# Altium schematic sheet 14 LCD Power Supply.SchDoc
size C; DocumentNumber: 14; SheetNumber: 14; SheetTotal: 17
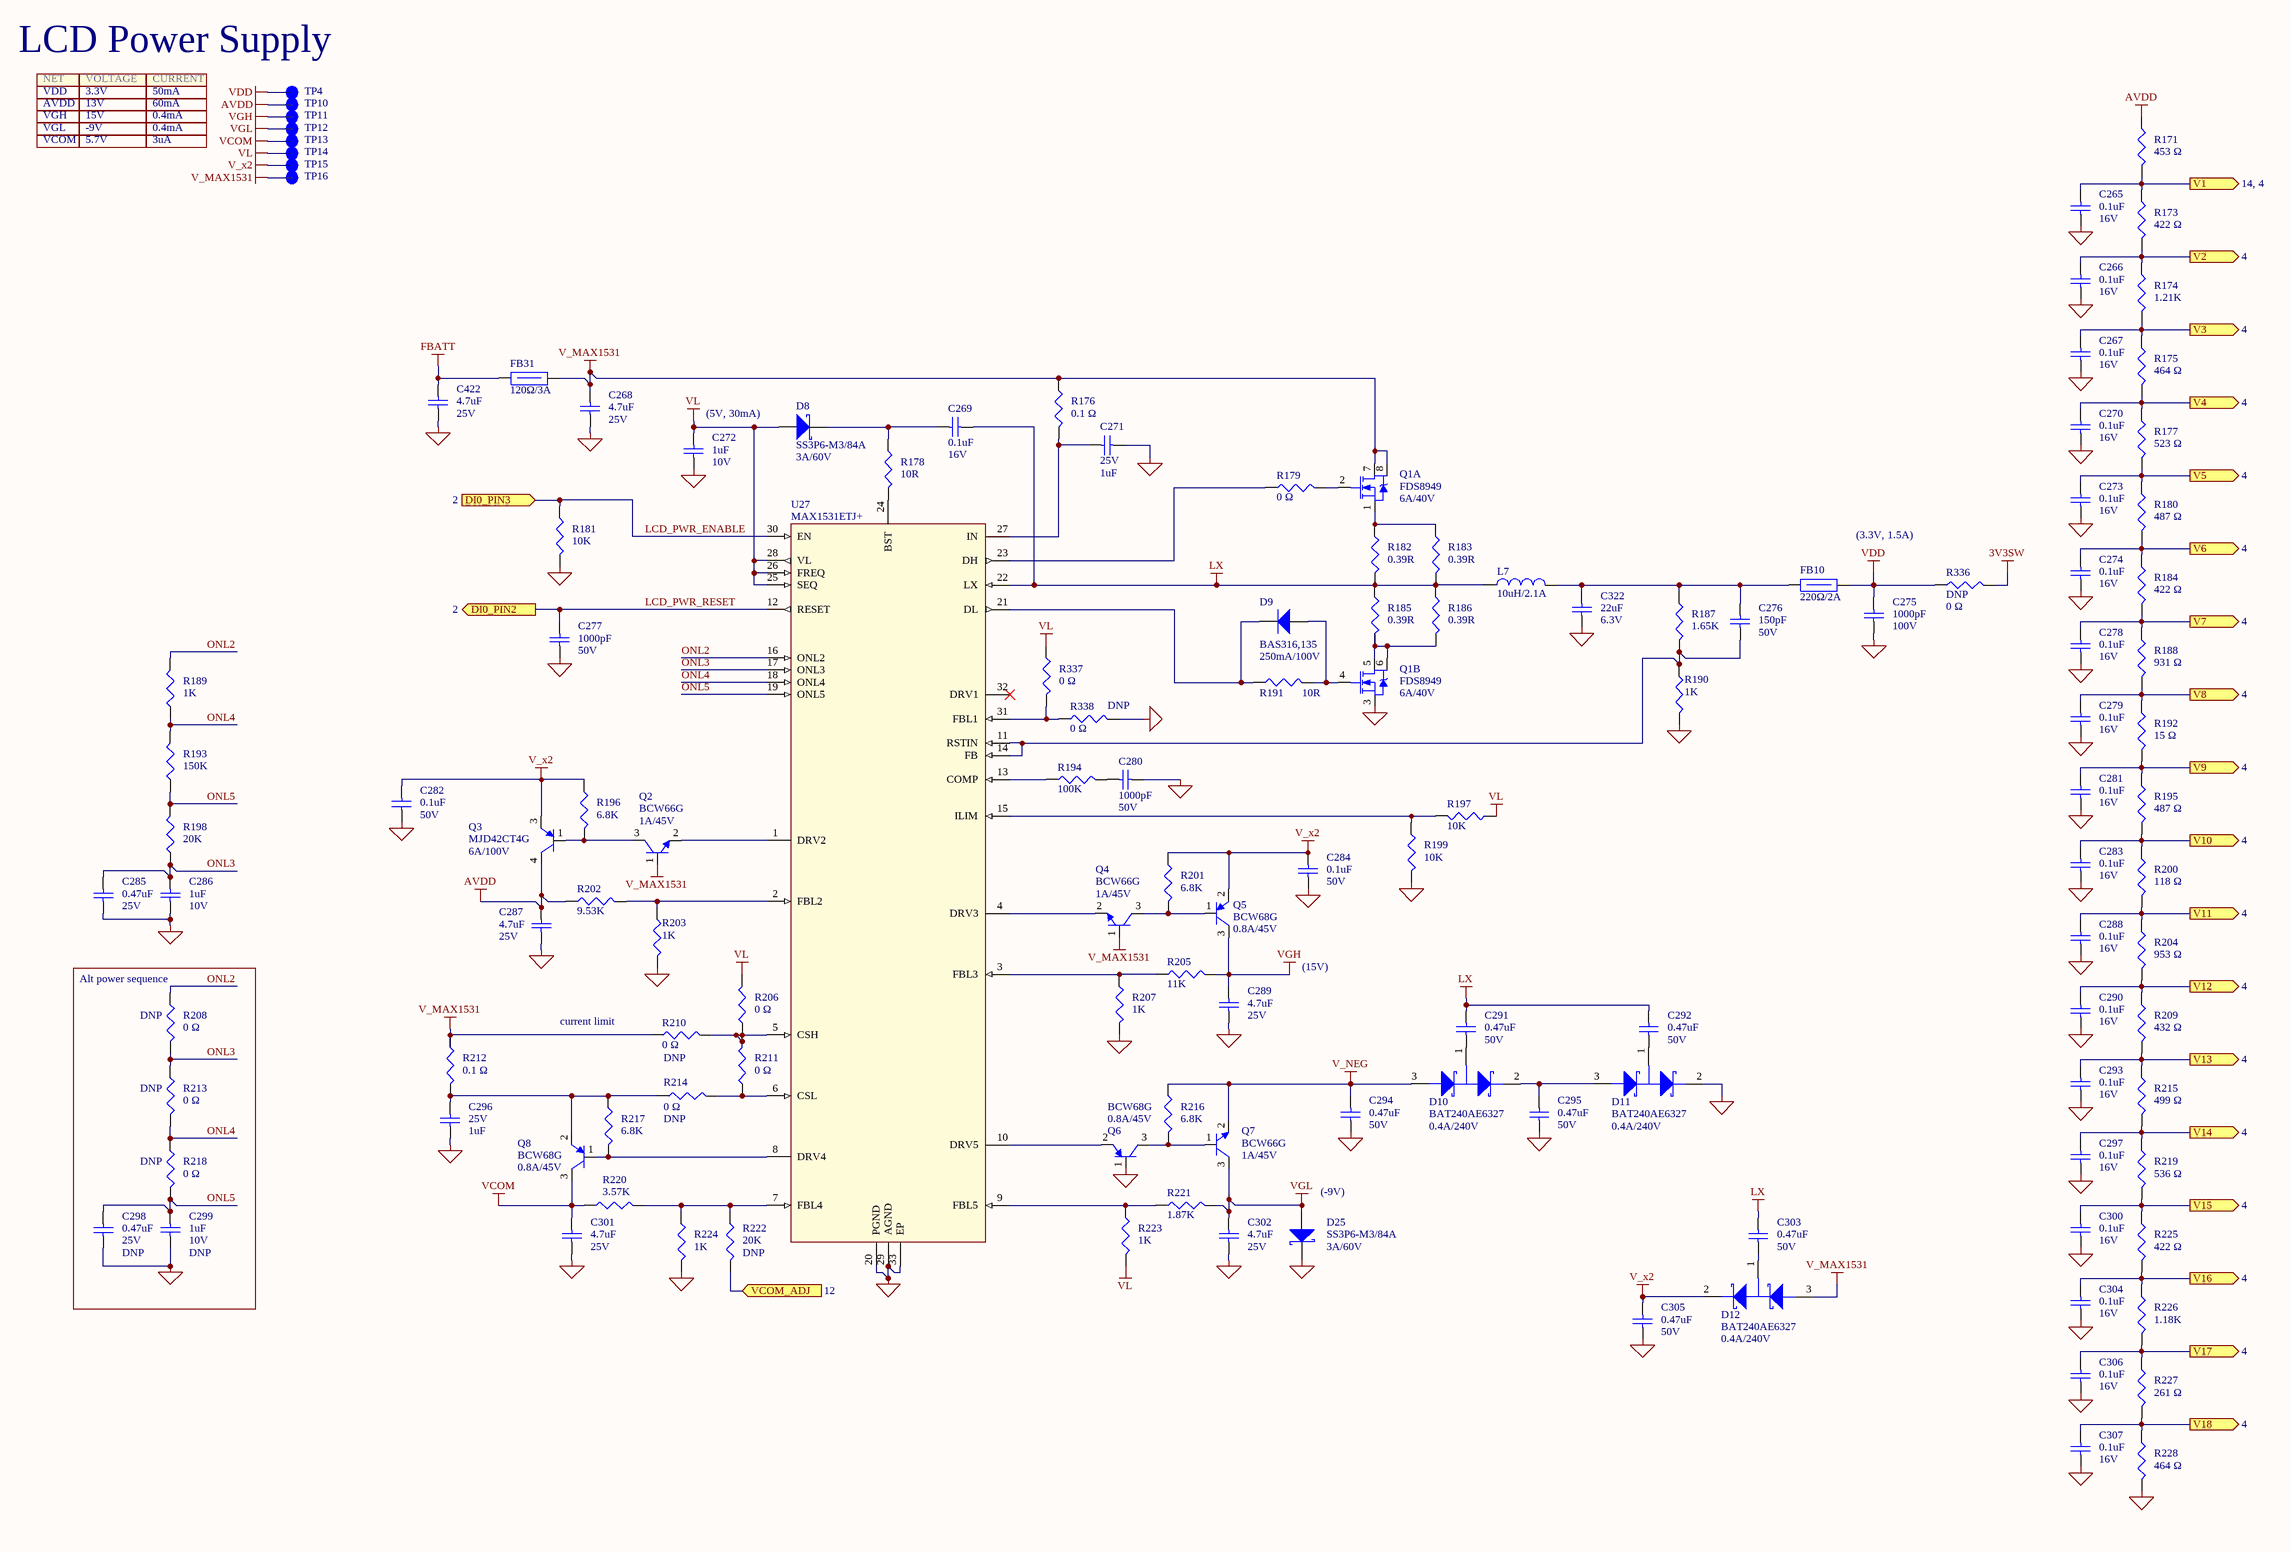
[diagram p0: 14 LCD Power Supply.SchDoc]

## Parts
C265  value 0.1uF  Voltage: 16V  [CAP_0402]  (hidden comment: Cap 0.1uF 16V 0402)
C266  value 0.1uF  Voltage: 16V  [CAP_0402]  (hidden comment: Cap 0.1uF 16V 0402)
C267  value 0.1uF  Voltage: 16V  [CAP_0402]  (hidden comment: Cap 0.1uF 16V 0402)
C268  value 4.7uF  Voltage: 25V  [CAP_0805]  (hidden comment: Cap 4.7uF 25V 0805)
C269  value 0.1uF  Voltage: 16V  [CAP_0402]  (hidden comment: Cap 0.1uF 16V 0402)
C270  value 0.1uF  Voltage: 16V  [CAP_0402]  (hidden comment: Cap 0.1uF 16V 0402)
C271  value 1uF  Voltage: 25V  [CAP_0402]  (hidden comment: Cap 1uF 25V 0402)
C272  value 1uF  Voltage: 10V  [CAP_0402]  (hidden comment: Cap 1uF 10V 0402)
C273  value 0.1uF  Voltage: 16V  [CAP_0402]  (hidden comment: Cap 0.1uF 16V 0402)
C274  value 0.1uF  Voltage: 16V  [CAP_0402]  (hidden comment: Cap 0.1uF 16V 0402)
C275  value 1000pF  Voltage: 100V  [CAP_0402]  (hidden comment: Cap 1000pF 100V 0402)
C276  value 150pF  Voltage: 50V  [CAP_0402]  (hidden comment: Cap 150pF 50V 0603)
C277  value 1000pF  Voltage: 50V  [CAP_0603]  (hidden comment: Cap 1000pF 50V 0603)
C278  value 0.1uF  Voltage: 16V  [CAP_0402]  (hidden comment: Cap 0.1uF 16V 0402)
C279  value 0.1uF  Voltage: 16V  [CAP_0402]  (hidden comment: Cap 0.1uF 16V 0402)
C280  value 1000pF  Voltage: 50V  [CAP_0603]  (hidden comment: Cap 1000pF 50V 0603)
C281  value 0.1uF  Voltage: 16V  [CAP_0402]  (hidden comment: Cap 0.1uF 16V 0402)
C282  value 0.1uF  Voltage: 50V  [CAP_0402]  (hidden comment: Cap 0.1uF 50V 0402)
C283  value 0.1uF  Voltage: 16V  [CAP_0402]  (hidden comment: Cap 0.1uF 16V 0402)
C284  value 0.1uF  Voltage: 50V  [CAP_0402]  (hidden comment: Cap 0.1uF 50V 0402)
C285  value 0.47uF  Voltage: 25V  [CAP_0603]  (hidden comment: Cap 0.47uF 25V 0603)
C286  value 1uF  Voltage: 10V  [CAP_0402]  (hidden comment: Cap 1uF 10V 0402)
C287  value 4.7uF  Voltage: 25V  [CAP_0805]  (hidden comment: Cap 4.7uF 25V 0805)
C288  value 0.1uF  Voltage: 16V  [CAP_0402]  (hidden comment: Cap 0.1uF 16V 0402)
C289  value 4.7uF  Voltage: 25V  [CAP_0805]  (hidden comment: Cap 4.7uF 25V 0805)
C290  value 0.1uF  Voltage: 16V  [CAP_0402]  (hidden comment: Cap 0.1uF 16V 0402)
C291  value 0.47uF  Voltage: 50V  [CAP_1206]  (hidden comment: Cap 0.47uF 50V 1206)
C292  value 0.47uF  Voltage: 50V  [CAP_1206]  (hidden comment: Cap 0.47uF 50V 1206)
C293  value 0.1uF  Voltage: 16V  [CAP_0402]  (hidden comment: Cap 0.1uF 16V 0402)
C294  value 0.47uF  Voltage: 50V  [CAP_1206]  (hidden comment: Cap 0.47uF 50V 1206)
C295  value 0.47uF  Voltage: 50V  [CAP_1206]  (hidden comment: Cap 0.47uF 50V 1206)
C296  value 1uF  Voltage: 25V  [CAP_0402]  (hidden comment: Cap 1uF 25V 0402)
C297  value 0.1uF  Voltage: 16V  [CAP_0402]  (hidden comment: Cap 0.1uF 16V 0402)
C298  value 0.47uF  Voltage: 25V  [CAP_0603]  (hidden comment: Cap 0.47uF 25V 0603)
C299  value 1uF  Voltage: 10V  [CAP_0402]  (hidden comment: Cap 1uF 10V 0402)
C300  value 0.1uF  Voltage: 16V  [CAP_0402]  (hidden comment: Cap 0.1uF 16V 0402)
C301  value 4.7uF  Voltage: 25V  [CAP_0805]  (hidden comment: Cap 4.7uF 25V 0805)
C302  value 4.7uF  Voltage: 25V  [CAP_0805]  (hidden comment: Cap 4.7uF 25V 0805)
C303  value 0.47uF  Voltage: 50V  [CAP_1206]  (hidden comment: Cap 0.47uF 50V 1206)
C304  value 0.1uF  Voltage: 16V  [CAP_0402]  (hidden comment: Cap 0.1uF 16V 0402)
C305  value 0.47uF  Voltage: 50V  [CAP_1206]  (hidden comment: Cap 0.47uF 50V 1206)
C306  value 0.1uF  Voltage: 16V  [CAP_0402]  (hidden comment: Cap 0.1uF 16V 0402)
C307  value 0.1uF  Voltage: 16V  [CAP_0402]  (hidden comment: Cap 0.1uF 16V 0402)
C322  value 22uF  Voltage: 6.3V  [CAP_0805]  (hidden comment: Cap 22uF 6.3V 0805)
C422  value 4.7uF  Voltage: 25V  [CAP_0805]  (hidden comment: Cap 4.7uF 25V 0805)
D8  SS3P6-M3/84A  value 3A/60V  [DO-220AA_SS3P6-M3/84A]
D9  BAS316,135  value 250mA/100V  [SOD-323-BAS316,135]
D10  BAT240AE6327  value 0.4A/240V  [SOT-23-3_BAT240AE6327]
D11  BAT240AE6327  value 0.4A/240V  [SOT-23-3_BAT240AE6327]
D12  BAT240AE6327  value 0.4A/240V  [SOT-23-3_BAT240AE6327]
D25  SS3P6-M3/84A  value 3A/60V  [DO-220AA_SS3P6-M3/84A]
FB10  value 220Ω/2A  [IND_0805]  (hidden comment: BKP2125HS221-T)
FB31  value 120Ω/3A  [IND_0603]  (hidden comment: BLM18KG121TN1D)
L7  value 10uH/2.1A  [IND_2020]  (hidden comment: TYS5040100M-10)
Q1  FDS8949  value 6A/40V  [SOIC-8_FDS8949]  (parts A,B of 2)
Q2  BCW66G  value 1A/45V  [SOT-23-3_BCW66G]
Q3  MJD42CT4G  value 6A/100V  [TO-252-3_MJD42CT4G]
Q4  BCW66G  value 1A/45V  [SOT-23-3_BCW66G]
Q5  BCW68G  value 0.8A/45V  [SOT-23-3_BCW68G]
Q6  BCW68G  value 0.8A/45V  [SOT-23-3_BCW68G]
Q7  BCW66G  value 1A/45V  [SOT-23-3_BCW66G]
Q8  BCW68G  value 0.8A/45V  [SOT-23-3_BCW68G]
R171  value 453 Ω  [RES_0402]  (hidden comment: Res 453R 0.063W)
R173  value 422 Ω  [RES_0402]  (hidden comment: Res 442R 0.063W)
R174  value 1.21K  [RES_0402]  (hidden comment: Res 1.21K 0.063W)
R175  value 464 Ω  [RES_0402]  (hidden comment: Res 464R 0.063W)
R176  value 0.1 Ω  [RES_1206]  (hidden comment: Res 0.1 ohm 1W)
R177  value 523 Ω  [RES_0402]  (hidden comment: Res 523R 0.063W)
R178  value 10R  [RES_0402]  (hidden comment: Res 10R 0.1W)
R179  value 0 Ω  [RES_0402]  (hidden comment: Res 0 ohm 0.1W)
R180  value 487 Ω  [RES_0402]  (hidden comment: Res 487R 0.063W)
R181  value 10K  [RES_0402]  (hidden comment: Res 10K 0.063W)
R182  value 0.39R  [RES_0805]  (hidden comment: Res 0.39R 0.25W)
R183  value 0.39R  [RES_0805]  (hidden comment: Res 0.39R 0.25W)
R184  value 422 Ω  [RES_0402]  (hidden comment: Res 442R 0.063W)
R185  value 0.39R  [RES_0805]  (hidden comment: Res 0.39R 0.25W)
R186  value 0.39R  [RES_0805]  (hidden comment: Res 0.39R 0.25W)
R187  value 1.65K  [RES_0402]  (hidden comment: Res 1.65K 0.1W)
R188  value 931 Ω  [RES_0402]  (hidden comment: Res 931R 0.063W)
R189  value 1K  [RES_0402]  (hidden comment: Res 1K 0.063W)
R190  value 1K  [RES_0402]  (hidden comment: Res 1K 0.063W)
R191  value 10R  [RES_0402]  (hidden comment: Res 10R 0.1W)
R192  value 15 Ω  [RES_0402]  (hidden comment: Res 15R 0.063W)
R193  value 150K  [RES_0402]  (hidden comment: Res 150K 0.063W)
R194  value 100K  [RES_0402]  (hidden comment: Res 100K 0.1W)
R195  value 487 Ω  [RES_0402]  (hidden comment: Res 487R 0.063W)
R196  value 6.8K  [RES_0402]  (hidden comment: Res 6.8K 0.1W)
R197  value 10K  [RES_0402]  (hidden comment: Res 10K 0.063W)
R198  value 20K  [RES_0402]  (hidden comment: Res 20K 0.1W)
R199  value 10K  [RES_0402]  (hidden comment: Res 10K 0.063W)
R200  value 118 Ω  [RES_0402]  (hidden comment: Res 118R 0.063W)
R201  value 6.8K  [RES_0402]  (hidden comment: Res 6.8K 0.1W)
R202  value 9.53K  [RES_0402]  (hidden comment: Res 9.53K 0.063W)
R203  value 1K  [RES_0402]  (hidden comment: Res 1K 0.063W)
R204  value 953 Ω  [RES_0402]  (hidden comment: Res 953R 0.063W)
R205  value 11K  [RES_0402]  (hidden comment: Res 11K 0.1W)
R206  value 0 Ω  [RES_0402]  (hidden comment: Res 0 ohm 0.1W)
R207  value 1K  [RES_0402]  (hidden comment: Res 1K 0.063W)
R208  value 0 Ω  [RES_0402]  (hidden comment: Res 0 ohm 0.1W)
R209  value 432 Ω  [RES_0402]  (hidden comment: Res 432R 0.063W)
R210  value 0 Ω  [RES_0402]  (hidden comment: Res 0 ohm 0.1W)
R211  value 0 Ω  [RES_0402]  (hidden comment: Res 0 ohm 0.1W)
R212  value 0.1 Ω  [RES_1206]  (hidden comment: Res 0.1 ohm 1W)
R213  value 0 Ω  [RES_0402]  (hidden comment: Res 0 ohm 0.1W)
R214  value 0 Ω  [RES_0402]  (hidden comment: Res 0 ohm 0.1W)
R215  value 499 Ω  [RES_0402]  (hidden comment: Res 499R 0.063W)
R216  value 6.8K  [RES_0402]  (hidden comment: Res 6.8K 0.1W)
R217  value 6.8K  [RES_0402]  (hidden comment: Res 6.8K 0.1W)
R218  value 0 Ω  [RES_0402]  (hidden comment: Res 0 ohm 0.1W)
R219  value 536 Ω  [RES_0402]  (hidden comment: Res 536R 0.063W)
R220  value 3.57K  [RES_0402]  (hidden comment: Res 3.57K 0.1W)
R221  value 1.87K  [RES_0402]  (hidden comment: Res 1.87K 0.063W)
R222  value 20K  [RES_0402]  (hidden comment: Res 20K 0.1W)
R223  value 1K  [RES_0402]  (hidden comment: Res 1K 0.063W)
R224  value 1K  [RES_0402]  (hidden comment: Res 1K 0.063W)
R225  value 422 Ω  [RES_0402]  (hidden comment: Res 442R 0.063W)
R226  value 1.18K  [RES_0402]  (hidden comment: Res 1.18K 0.063W)
R227  value 261 Ω  [RES_0402]  (hidden comment: Res 261R 0.063W)
R228  value 464 Ω  [RES_0402]  (hidden comment: Res 464R 0.063W)
R336  value 0 Ω  [RES_0402]  (hidden comment: Res 0 ohm 0.1W DNP)
R337  value 0 Ω  [RES_0402]  (hidden comment: Res 0 ohm 0.1W)
R338  value 0 Ω  [RES_0402]  (hidden comment: Res 0 ohm 0.1W)
TP4  TP  [TP_TH_12_20]  (value not drawn)  (no BOM)
TP10  TP  [TP_TH_12_20]  (value not drawn)  (no BOM)
TP11  TP  [TP_TH_12_20]  (value not drawn)  (no BOM)
TP12  TP  [TP_TH_12_20]  (value not drawn)  (no BOM)
TP13  TP  [TP_TH_12_20]  (value not drawn)  (no BOM)
TP14  TP  [TP_TH_12_20]  (value not drawn)  (no BOM)
TP15  TP  [TP_TH_12_20]  (value not drawn)  (no BOM)
TP16  TP  [TP_TH_12_20]  (value not drawn)  (no BOM)
U27  MAX1531ETJ+  [TQFN-32_MAX1531ETJ+]

## Blocks framed on the sheet
Alt power sequence: C298 C299 R208 R213 R218

## Ports
DI0_PIN2 (out, see 2), DI0_PIN3 (in, see 2), V1 (out, see 14, 4), V2 (out, see 4), V3 (out, see 4), V4 (out, see 4), V5 (out, see 4), V6 (out, see 4), V7 (out, see 4), V8 (out, see 4), V9 (out, see 4), V10 (out, see 4), V11 (out, see 4), V12 (out, see 4), V13 (out, see 4), V14 (out, see 4), V15 (out, see 4), V16 (out, see 4), V17 (out, see 4), V18 (out, see 4), VCOM_ADJ (in, see 12)

## Nets
3V3SW: R336.2
AVDD: C287.1 Q3.4(C) R171.1 R202.1 TP10.1
FBATT: C422.1 FB31.1
GND: C265.2 C266.2 C267.2 C268.2 C270.2 C271.2 C272.2 C273.2 C274.2 C275.2 C277.2 C278.2 C279.2 C280.2 C281.2 C282.2 C283.2 C284.2 C285.2 C286.2 C287.2 C288.2 C289.2 C290.2 C293.2 C294.2 C295.2 C296.2 C297.2 C298.2 C299.2 C300.2 C301.2 C302.2 C304.2 C305.2 C306.2 C307.2 C322.2 C422.2 D11.2(K2) D25.K Q1.3(S2) Q6.1(B) R181.2 R190.2 R199.2 R203.2 R207.2 R224.2 R228.2 R338.2 U27.20(PGND) U27.29(AGND) U27.33(EP)
LX: C269.2 C291.2 C292.2 C303.1 L7.1 R182.2 R183.2 R185.1 R186.1 U27.22(LX)
V_MAX1531: C268.1 D12.3(A1) FB31.2 Q1.7(D1) Q1.8(D1) Q2.1(B) Q4.1(B) R176.1 R210.1 R212.1 TP16.1
V_NEG: C294.1 D10.3(A1) Q7.2(E) R216.1
V_x2: C282.1 C284.1 C305.1 D12.2(K2) Q3.3(E) Q5.2(E) R196.1 R201.1 TP15.1
VCOM: C301.1 Q8.3(C) R220.1 TP13.1
VDD: C275.1 FB10.2 R336.1 TP4.1
VGH: C289.1 Q5.3(C) R205.2 TP11.1
VGL: C302.1 D25.A Q7.3(C) R221.2 TP12.1
VL: C272.1 D8.A R197.1 R206.2 R223.2 R337.1 TP14.1 U27.25(SEQ) U27.26(FREQ) U27.28(VL)
LCD_PWR_ENABLE: R181.1 U27.30(EN) ; port DI0_PIN3
LCD_PWR_RESET: C277.1 U27.12(RESET) ; port DI0_PIN2
ONL2: R189.2 R208.1 U27.16(ONL2)
ONL3: C285.1 C286.1 R198.1 R208.2 R213.1 U27.17(ONL3)
ONL4: R189.1 R193.2 R213.2 R218.1 U27.18(ONL4)
ONL5: C298.1 C299.1 R193.1 R198.2 R218.2 U27.19(ONL5)
V1: C265.1 R171.2 R173.1 ; port V1
V2: C266.1 R173.2 R174.1 ; port V2
V3: C267.1 R174.2 R175.1 ; port V3
V4: C270.1 R175.2 R177.1 ; port V4
V5: C273.1 R177.2 R180.1 ; port V5
V6: C274.1 R180.2 R184.1 ; port V6
V7: C278.1 R184.2 R188.1 ; port V7
V8: C279.1 R188.2 R192.1 ; port V8
V9: C281.1 R192.2 R195.1 ; port V9
V10: C283.1 R195.2 R200.1 ; port V10
V11: C288.1 R200.2 R204.1 ; port V11
V12: C290.1 R204.2 R209.1 ; port V12
V13: C293.1 R209.2 R215.1 ; port V13
V14: C297.1 R215.2 R219.1 ; port V14
V15: C300.1 R219.2 R225.1 ; port V15
V16: C304.1 R225.2 R226.1 ; port V16
V17: C306.1 R226.2 R227.1 ; port V17
V18: C307.1 R227.2 R228.1 ; port V18
VCOM_ADJ: R222.2 ; port VCOM_ADJ
NetC269_1: C269.1 D8.K R178.1
NetC271_1: C271.1 R176.2 U27.27(IN)
NetC276_1: C276.1 C322.1 FB10.1 L7.2 R187.1
NetC276_2: C276.2 R187.2 R190.1 U27.11(RSTIN) U27.14(FB)
NetC280_1: C280.1 R194.2
NetC291_1: C291.1 D10.1
NetC292_1: C292.1 D11.1
NetC295_1: C295.1 D10.2(K2) D11.3(A1)
NetC296_1: C296.1 Q8.2(E) R212.2 R214.1 R217.1
NetC303_2: C303.2 D12.1
NetD9_A: D9.A Q1.4(G2) R191.2
NetD9_K: D9.K R191.1 U27.21(DL)
NetQ1_1: Q1.1(S1) R182.1 R183.1
NetQ1_2: Q1.2(G1) R179.2
NetQ1_5: Q1.5(D2) Q1.6(D2) R185.2 R186.2
NetQ2_2: Q2.2(E) U27.1(DRV2)
NetQ2_3: Q2.3(C) Q3.1(B) R196.2
NetQ4_2: Q4.2(E) U27.4(DRV3)
NetQ4_3: Q4.3(C) Q5.1(B) R201.2
NetQ6_2: Q6.2(E) U27.10(DRV5)
NetQ6_3: Q6.3(C) Q7.1(B) R216.2
NetQ8_1: Q8.1(B) R217.2 U27.8(DRV4)
NetR178_2: R178.2 U27.24(BST)
NetR179_1: R179.1 U27.23(DH)
NetR194_1: R194.1 U27.13(COMP)
NetR197_2: R197.2 R199.1 U27.15(ILIM)
NetR202_2: R202.2 R203.1 U27.2(FBL2)
NetR205_1: R205.1 R207.1 U27.3(FBL3)
NetR206_1: R206.1 R210.2 R211.2 U27.5(CSH)
NetR211_1: R211.1 R214.2 U27.6(CSL)
NetR220_2: R220.2 R222.1 R224.1 U27.7(FBL4)
NetR221_1: R221.1 R223.1 U27.9(FBL5)
NetR337_2: R337.2 R338.1 U27.31(FBL1)

Not connected (* = marked no-connect by the designer): U27 32(DRV1)*

## Notes on the sheet
- LCD Power Supply
- VDD
- NET
- AVDD
- VGH
- 3.3V
- VOLTAGE
- 13V
- 15V
- CURRENT
- 50mA
- 60mA
- 0.4mA
- VGL
- VCOM
- -9V
- 5.7V
- 3uA
- (5V, 30mA)
- (3.3V, 1.5A)
- (15V)
- (near R210) current limit
- (near D25) (-9V)
- First View Consultants
- Austin, Tx
- 512.582.9102
- Drawn:
- Title:
- Sheet
- of
- firstviewconsultants.com
- FVC #:
- Checked:
- Approved:
- Date:
- File:
- Rev.
- Time:

## Library data of the parts
C265-C267 C269 C270 C273 C274 C278 C279 C281 C283 C288 C290 C293 C297 C300 C304 C306 C307 = Cap 0.1uF 16V 0402: Cap, Cer, 0.1uF, 16V, 10%, X7R, 0402; Manufacturer #: GRM155R71C104KA88D; Manufacturer: Murata Electronics North America; Have Footprint: yes; Package: 0402; Tolerance: ±10%
C268 C287 C289 C301 C302 C422 = Cap 4.7uF 25V 0805: Cap, Cer, 4.7uF, 25V, 10%, X5R, 0805; Manufacturer: Murata Electronics North America; Manufacturer #: GRM21BR61E475KA12K; Have Footprint: yes; Tolerance: 10%; PACKAGE: 0805
C271 C296 = Cap 1uF 25V 0402: Cap, Cer, 1uF, 25V, 10%, X5R, 0402; Manufacturer #: TMK105BJ105MV-F; Manufacturer: Taiyo Yuden; Have Footprint: yes; Package: 0402
C272 C286 C299 = Cap 1uF 10V 0402: Cap, Cer, 1uF, 10V, ±10%, X5R, 0402; Manufacturer #: CC0402KRX5R6BB105; Manufacturer: Yageo; Have Footprint: yes; Package: 0402
  C299: DNP: DNP
C275 = Cap 1000pF 100V 0402: Cap, Cer, 1000pF, 100V, 20%, X7S, 0402; Manufacturer: TDK Corporation; Manufacturer #: C1005X7S2A102M050BB; Have Footprint: yes; Tolerance: 20%; PACKAGE: 0402
C276 = Cap 150pF 50V 0603: Cap, Cer, 150pF, 50V, 5%, C0G/NP0, 0603; Manufacturer: Samsung Electro-Mechanics America, Inc; Manufacturer #: CL05C151JB5NNNC; Have Footprint: yes; Tolerance: 5%; PACKAGE: 0402
C277 C280 = Cap 1000pF 50V 0603: Cap, Cer, 1000pF, 50V, 10%, X7S, 0603; Manufacturer: Yageo; Manufacturer #: CC0603KRX7R9BB102; Have Footprint: yes; Tolerance: 10%; PACKAGE: 0402
C282 C284 = Cap 0.1uF 50V 0402: Cap, Cer, 0.1uF, 50V, 10%, X5R, 0402; Manufacturer #: C1005X5R1H104K; Manufacturer: TDK Corporation; Have Footprint: yes; Tolerance: ±10%; Package: 0402
C285 C298 = Cap 0.47uF 25V 0603: Cap, Cer, 0.47uF, 25V, 10%, X7R, 0603; Manufacturer: Samsung Electro-Mechanics America, Inc; Manufacturer #: CL10B474KA8NFNC; Have Footprint: yes; Package: 0603; Tolerance: 10%
  C298: DNP: DNP
C291 C292 C294 C295 C303 C305 = Cap 0.47uF 50V 1206: Cap, Cer, 0.47uF, 50V, 10%, X7R, 1206; Manufacturer: Yageo; Manufacturer #: CC1206KKX7R9BB474; Have Footprint: yes; Package: 1206; Tolerance: 10%
C322 = Cap 22uF 6.3V 0805: Cap, Cer, 22uF, 6.3V, 20%, X5R, 0805; Manufacturer #: GRM21BR60J226ME39L; Manufacturer: Murata Electronics North America; Have Footprint: yes; Tolerance: ±20%; Package: 0805
D8 D25 = SS3P6-M3/84A: Diode, Schottky, 3A, 60V, DO-220AA; Manufacturer: Vishay; Package: DO-220AA; Manufacturer #: SS3P6-M3/84A
D9 = BAS316,135: Diode, 250mA, 100V, SOD-323; Manufacturer: NXP Semiconductors; Package: SOD-323; Manufacturer #: BAS316,135
D10-D12 = BAT240AE6327: Diode, Schottky, 0.4A, 240V, SOT-23-3; Manufacturer: Infineon Technologies; Package: SOT-23-3; Manufacturer #: BAT 240A E6327
FB10 = BKP2125HS221-T: Ind, Ferrite Bead, 220R, 50mOhm, 2A, 0805; Manufacturer: Taiyo Yuden; Manufacturer #: BKP2125HS221-T; Package: 0805
FB31 = BLM18KG121TN1D: Ind, Ferrite Bead, 120R, 20mOhm, 3A, 0603; Manufacturer: Murata Electronics North America; Have Footprint: yes; RoHS: yes; Package: 0603; Manufacturer #: BLM18KG121TN1D
L7 = TYS5040100M-10: Ind, Power, 10uH, 2.1A, 2020; Manufacturer: Laird-Signal Integrity Products; Tolerance: ±20%; RoHS: yes; Operating Temperature: -40°C ~ 125°C; Package: 2020; Manufacturer #: TYS5040100M-10
Q1 = FDS8949: Transistor, N-MOS, 6A, 40V, 29 mOhm, SOIC-8; Manufacturer: Fairchild Semiconductor; Package: SOIC-8; Manufacturer #: FDS8949
Q2 Q4 Q7 = BCW66G: Transistor, NPN, 1A, 45V, SOT-23-3; Manufacturer: Fairchild Semiconductor; Package: SOT-23-3; Manufacturer #: BCW66G
Q3 = MJD42CT4G: Transistor, PNP, 6A, 100V, TO-252-3; Manufacturer: ON Semiconductor; Package: TO-252-3; Manufacturer #: MJD42CT4G
Q5 Q6 Q8 = BCW68G: Transistor, PNP, 0.8A, 45V, SOT-23-3; Manufacturer: Fairchild Semiconductor; Package: SOT-23-3; Manufacturer #: BCW68G
R171 = Res 453R 0.063W: Res, 453R, 0.063W, 1%, 0402; Manufacturer #: RMCF0402FT453R; Manufacturer: Stackpole Electronics Inc; Have Footprint: yes; Package: 0402
R173 R184 R225 = Res 442R 0.063W: Res, 442R, 0.063W, 1%, 0402; Manufacturer #: RMCF0402FT442R; Manufacturer: Stackpole Electronics Inc; Have Footprint: yes; Package: 0402
R174 = Res 1.21K 0.063W: Res, 1.21K, 0.063W, 1%, 0402; Manufacturer #: RMCF0402FT1K21; Manufacturer: Stackpole Electronics Inc; Package: 0402
R175 R228 = Res 464R 0.063W: Res, 464R, 0.063W, 1%, 0402; Manufacturer #: RMCF0402FT464R; Manufacturer: Stackpole Electronics Inc; Have Footprint: yes; Package: 0402
R176 R212 = Res 0.1 ohm 1W: Res, 0.1 ohm, 1W, 1%, 1206; Manufacturer #: RUW3216FR100CS; Manufacturer: Samsung Electro-Mechanics America, Inc; Package: 1206
R177 = Res 523R 0.063W: Res, 523R, 0.063W, 1%, 0402; Manufacturer #: RMCF0402FT523R; Manufacturer: Stackpole Electronics Inc; Have Footprint: yes; Package: 0402
R178 R191 = Res 10R 0.1W: Res, 10R, 0.1W, 0402; Manufacturer #: ERJ-2GEJ100X; Manufacturer: Panasonic Electronic Components; Have Footprint: yes; Package: 0402
R179 R206 R208 R210 R211 R213 R214 R218 R337 R338 = Res 0 ohm 0.1W: Res, 0 ohm, 1/16W, 0402; Manufacturer #: CRCW04020000Z0ED; Manufacturer: Vishay Dale; Have Footprint: yes; Package: 0402
  R208 R210 R213 R214 R218 R338: DNP: DNP
R180 R195 = Res 487R 0.063W: Res, 467R, 0.063W, 1%, 0402; Manufacturer #: RMCF0402FT487R; Manufacturer: Stackpole Electronics Inc; Have Footprint: yes; Package: 0402
R181 R197 R199 = Res 10K 0.063W: Res, 10K, 1/16W, 1%, 0402; Manufacturer #: RC0402FR-0710KL; Manufacturer: Yageo; Have Footprint: yes; Package: 0402
R182 R183 R185 R186 = Res 0.39R 0.25W: Res, 0.39R, 0.25W, 1%, 0805; Manufacturer #: RUT2012FR390CS; Manufacturer: Samsung Electro-Mechanics America, Inc; Package: 0402
R187 = Res 1.65K 0.1W: Res, 1.65K, 0.1W, 1%, 0402; Manufacturer #: ERJ-2RKF1651X; Manufacturer: Panasonic Electronic Components; Have Footprint: yes; Package: 0402; Tolerance: 1%
R188 = Res 931R 0.063W: Res, 931R, 0.063W, 1%, 0402; Manufacturer #: ERJ-2RKF9310X; Manufacturer: Panasonic Electronic Components; Have Footprint: yes; Package: 0402
R189 R190 R203 R207 R223 R224 = Res 1K 0.063W: Res, 1K, 0.063W, 1%, 0402; Manufacturer #: CRCW04021K00FKED; Manufacturer: Vishay Dale; Have Footprint: yes; Package: 0402; Tolerance: ±1%
R192 = Res 15R 0.063W: Res, 15R, 0.063W, 1%, 0402; Manufacturer #: RMCF0402JT15R0; Manufacturer: Stackpole Electronics Inc; Have Footprint: yes; Package: 0402
R193 = Res 150K 0.063W: Res, 150K, 0.063W, 1%, 0402; Manufacturer #: MCR01MRTF1503; Manufacturer: Rohm Semiconductor; Have Footprint: yes; Package: 0402; Tolerance: 1%
R194 = Res 100K 0.1W: Res, 100K, 0.1W, 1%, 0402; Manufacturer #: ERJ-2RKF1003X; Manufacturer: Panasonic Electronic Components; Have Footprint: yes; Package: 0402
R196 R201 R216 R217 = Res 6.8K 0.1W: Res, 6.8K, 0.1W, 1%, 0402; Manufacturer #: ERJ-2RKF6801X; Manufacturer: Panasonic Electronic Components; Have Footprint: yes; Package: 0402
R198 R222 = Res 20K 0.1W: Res, 20K, 0.1W, 1%, 0402; Manufacturer #: ERJ-2RKF2002X; Manufacturer: Panasonic Electronic Components; Have Footprint: yes; Package: 0402
  R222: DNP: DNP
R200 = Res 118R 0.063W: Res, 118R, 0.063W, 1%, 0402; Manufacturer #: RC0402FR-07118RL; Manufacturer: Yageo; Package: 0402
R202 = Res 9.53K 0.063W: Res, 9.53K, 0.063W, 1%, 0402; Manufacturer #: RC0402FR-079K53L; Manufacturer: Yageo; Have Footprint: yes; Package: 0402
R204 = Res 953R 0.063W: Res, 953R, 0.063W, 1%, 0402; Manufacturer #: RMCF0402FT953R; Manufacturer: Stackpole Electronics Inc; Have Footprint: yes; Package: 0402
R205 = Res 11K 0.1W: Res, 11K, 0.1W, 1%, 0402; Manufacturer #: ERJ-2GEJ113X; Manufacturer: Panasonic Electronic Components; Have Footprint: yes; Package: 0402
R209 = Res 432R 0.063W: Res, 432R, 0.063W, 1%, 0402; Manufacturer #: RMCF0402FT432R; Manufacturer: Stackpole Electronics Inc; Have Footprint: yes; Package: 0402
R215 = Res 499R 0.063W: Res, 499R, 0.063W, 1%, 0402; Manufacturer #: RMCF0402FT499R; Manufacturer: Stackpole Electronics Inc; Have Footprint: yes; Package: 0402
R219 = Res 536R 0.063W: Res, 536R, 0.063W, 1%, 0402; Manufacturer #: RMCF0402FT536R; Manufacturer: Stackpole Electronics Inc; Have Footprint: yes; Package: 0402
R220 = Res 3.57K 0.1W: Res, 3.57K, 0.1W, 1%, 0402; Manufacturer #: ERJ-2RKF3571X; Manufacturer: Panasonic Electronic Components; Have Footprint: yes; Package: 0402
R221 = Res 1.87K 0.063W: Res, 1.87K, 0.063W, 1%, 0402; Manufacturer #: RMCF0402FT1K87; Manufacturer: Stackpole Electronics Inc; Have Footprint: yes; Package: 0402; Tolerance: 1%
R226 = Res 1.18K 0.063W: Res, 1.18K, 0.063W, 1%, 0402; Manufacturer #: RMCF0402FT1K18; Manufacturer: Stackpole Electronics Inc; Package: 0402
R227 = Res 261R 0.063W: Res, 261R, 0.063W, 1%, 0402; Manufacturer #: RMCF0402FT261R; Manufacturer: Stackpole Electronics Inc; Have Footprint: yes; Package: 0402; Tolerance: 1%
R336 = Res 0 ohm 0.1W DNP: Res, 0 ohm, 1/16W, 0402; Manufacturer #: CRCW04020000Z0ED; Manufacturer: Vishay Dale; Have Footprint: yes; Package: 0402; DNP: DNP
TP4 TP10-TP16 = TestPoint: Testpad; DNP: DNP
U27 = MAX1531ETJ+: IC, LCD Power, 4.5-28V, TQFN-32; Manufacturer: Maxim Integrated; Have Footprint: yes; RoHS: yes; Manufacturer #: MAX1531ETJ+; Package: TQFN-32